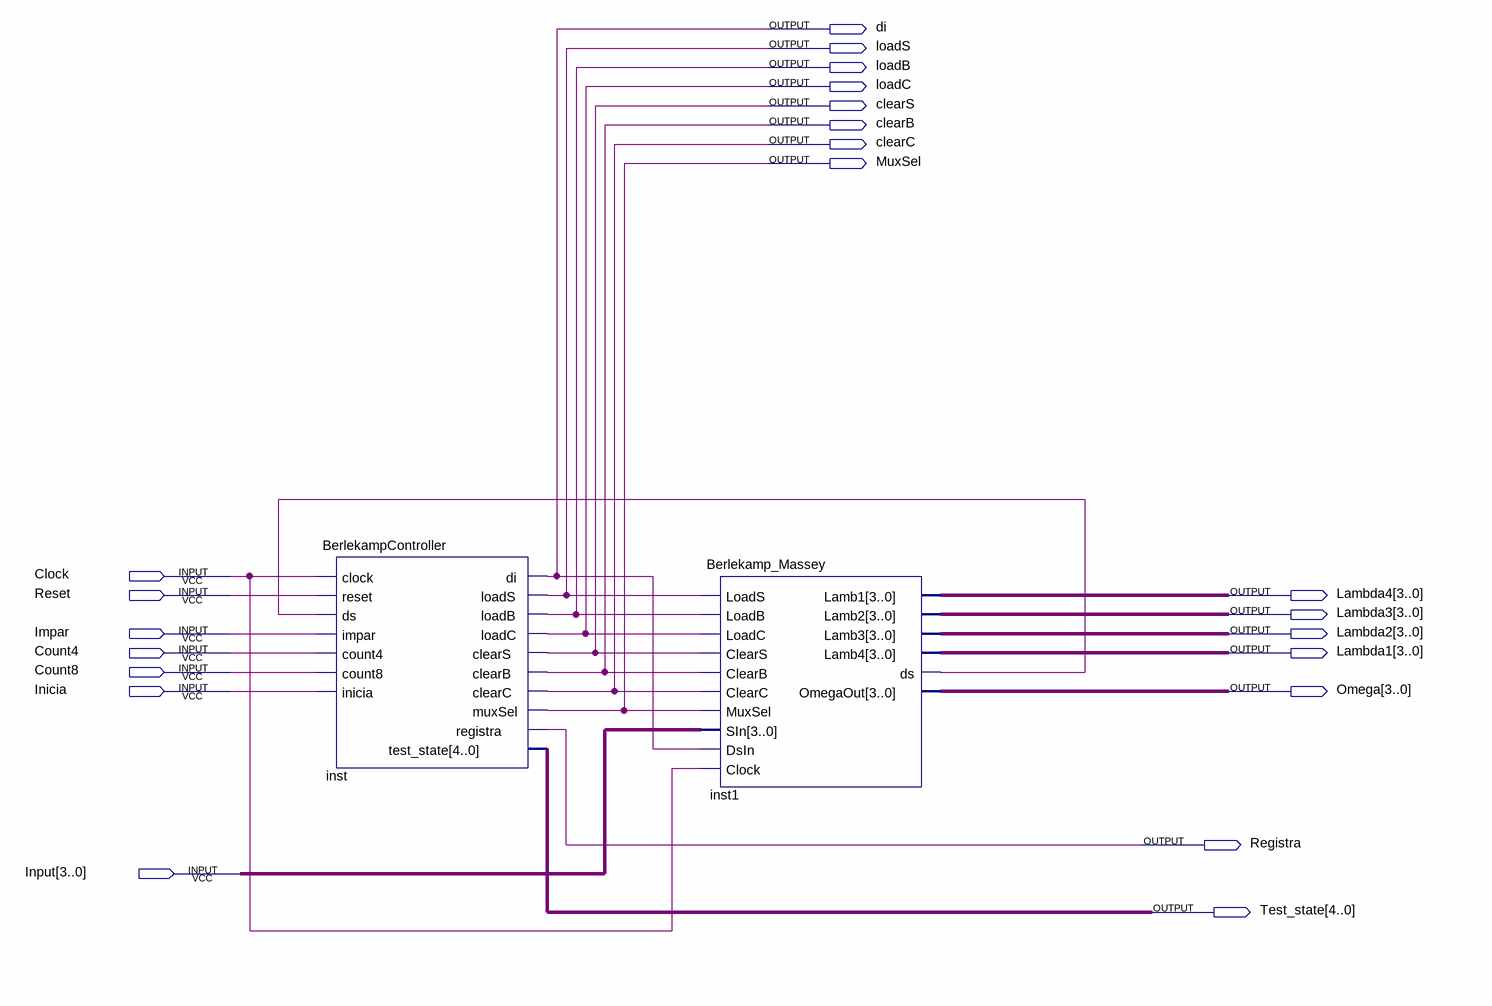
[diagram p0: schematic sheet]
// Quartus schematic BerleMas.bdf as structural Verilog: 2 symbols, 22 pins
module BerleMas (
  input  Clock,
  input  Reset,
  input  Impar,
  input  Count4,
  input  Count8,
  input  Inicia,
  input  [3:0] Input,
  output di,
  output loadS,
  output loadB,
  output loadC,
  output clearS,
  output clearB,
  output clearC,
  output MuxSel,
  output [3:0] Lambda4,
  output [3:0] Lambda3,
  output [3:0] Lambda2,
  output [3:0] Lambda1,
  output [3:0] Omega,
  output Registra,
  output [4:0] Test_state
);

  wire inst1_ds;

  BerlekampController inst (
    .clock(Clock), .reset(Reset), .ds(inst1_ds), .impar(Impar), .count4(Count4), .count8(Count8),
    .inicia(Inicia), .di(di), .loadS(loadS), .loadB(loadB), .loadC(loadC), .clearS(clearS), .clearB(clearB),
    .clearC(clearC), .muxSel(MuxSel), .registra(Registra), .test_state(Test_state));
  Berlekamp_Massey inst1 (
    .LoadS(loadS), .LoadB(loadB), .LoadC(loadC), .ClearS(clearS), .ClearB(clearB), .ClearC(clearC),
    .MuxSel(MuxSel), .SIn(Input), .DsIn(di), .Clock(Clock), .Lamb1(Lambda4), .Lamb2(Lambda3),
    .Lamb3(Lambda2), .Lamb4(Lambda1), .ds(inst1_ds), .OmegaOut(Omega));
endmodule
